# Altium schematic sheet AY Amp.SchDoc
size A3; SheetNumber: 3; SheetTotal: 15
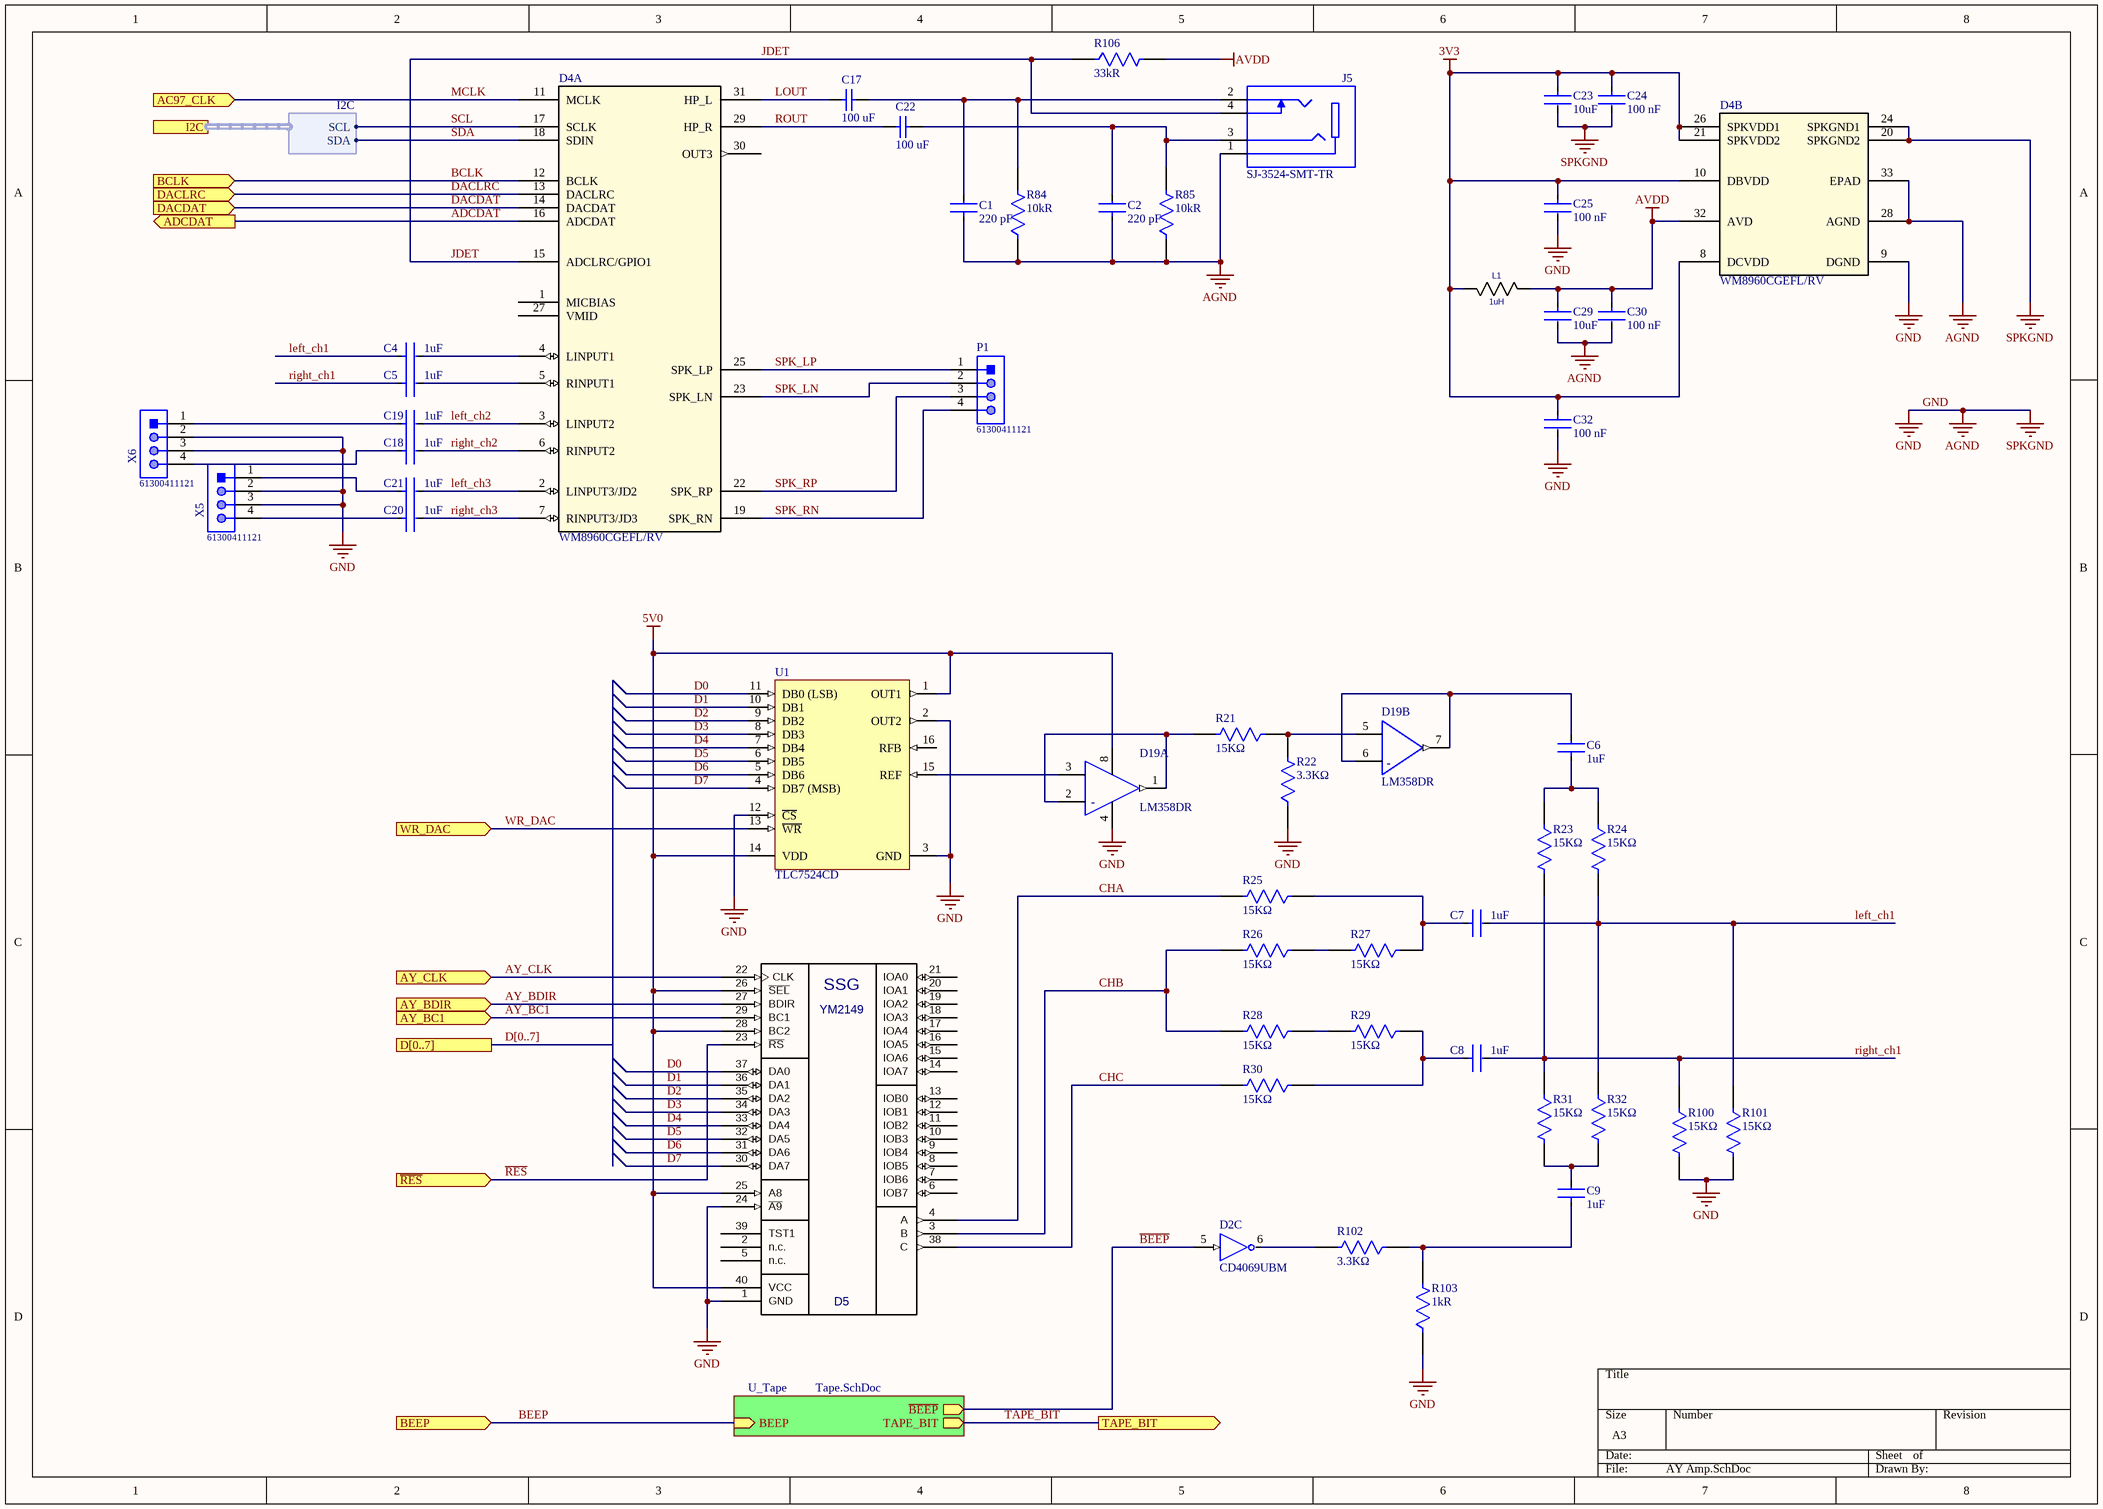
[diagram p0: AY Amp.SchDoc]

## Parts
C1  Capacitance: 220 pF  [FP-CC0805-0_85-IPC_A]  (hidden comment: CC0805KRX7R9BB221)
C2  Capacitance: 220 pF  [FP-CC0805-0_85-IPC_A]  (hidden comment: CC0805KRX7R9BB221)
C4  Capacitance: 1uF  [FP-GCM21B-0_15-IPC_A]  (hidden comment: GCM21BR71E105KA56L)
C5  Capacitance: 1uF  [FP-GCM21B-0_15-IPC_A]  (hidden comment: GCM21BR71E105KA56L)
C6  Capacitance: 1uF  [FP-GCM21B-0_15-IPC_A]  (hidden comment: GCM21BR71E105KA56L)
C7  Capacitance: 1uF  [FP-GCM21B-0_15-IPC_A]  (hidden comment: GCM21BR71E105KA56L)
C8  Capacitance: 1uF  [FP-GCM21B-0_15-IPC_A]  (hidden comment: GCM21BR71E105KA56L)
C9  Capacitance: 1uF  [FP-GCM21B-0_15-IPC_A]  (hidden comment: GCM21BR71E105KA56L)
C17  Capacitance: 100 uF  [CAPC3216X190X55ML30T25]  (hidden comment: GRM31CR60J107ME39L)
C18  Capacitance: 1uF  [FP-GCM21B-0_15-IPC_A]  (hidden comment: GCM21BR71E105KA56L)
C19  Capacitance: 1uF  [FP-GCM21B-0_15-IPC_A]  (hidden comment: GCM21BR71E105KA56L)
C20  Capacitance: 1uF  [FP-GCM21B-0_15-IPC_A]  (hidden comment: GCM21BR71E105KA56L)
C21  Capacitance: 1uF  [FP-GCM21B-0_15-IPC_A]  (hidden comment: GCM21BR71E105KA56L)
C22  Capacitance: 100 uF  [CAPC3216X190X55ML30T25]  (hidden comment: GRM31CR60J107ME39L)
C23  Capacitance: 10uF  [FP-C0805C-DG-IPC_A]  (hidden comment: C0805C106K8PACTU)
C24  Capacitance: 100 nF  [FP-CC0805-0_85-IPC_A]  (hidden comment: CC0805KRX7R9BB104)
C25  Capacitance: 100 nF  [FP-CC0805-0_85-IPC_A]  (hidden comment: CC0805KRX7R9BB104)
C29  Capacitance: 10uF  [FP-C0805C-DG-IPC_A]  (hidden comment: C0805C106K8PACTU)
C30  Capacitance: 100 nF  [FP-CC0805-0_85-IPC_A]  (hidden comment: CC0805KRX7R9BB104)
C32  Capacitance: 100 nF  [FP-CC0805-0_85-IPC_A]  (hidden comment: CC0805KRX7R9BB104)
D2  CD4069UBM  [FP-D0014A-IPC_A]  (part C of 7)
D4  WM8960CGEFL/RV  [QFN50P500X500X90_HS-33M]  (parts A,B of 2)
D5  YM2149  [DIP40]
D19  LM358DR  [FP-D0008A-MFG]  (parts A,B of 2)
J5  SJ-3524-SMT-TR  [SJ-3524-SMT-TR]
L1  value 1uH  [L-CHIP]  (hidden comment: L-CHIP)
P1  61300411121  [61300411121]
R21  Resistance: 15KΩ  [FP-RN732A-IPC_A]  (hidden comment: RN73C2A15KBTDF)
R22  Resistance: 3.3KΩ  [FP-RT0805-IPC_A]  (hidden comment: RT0805FRE073K3L)
R23  Resistance: 15KΩ  [FP-RN732A-IPC_A]  (hidden comment: RN73C2A15KBTDF)
R24  Resistance: 15KΩ  [FP-RN732A-IPC_A]  (hidden comment: RN73C2A15KBTDF)
R25  Resistance: 15KΩ  [FP-RN732A-IPC_A]  (hidden comment: RN73C2A15KBTDF)
R26  Resistance: 15KΩ  [FP-RN732A-IPC_A]  (hidden comment: RN73C2A15KBTDF)
R27  Resistance: 15KΩ  [FP-RN732A-IPC_A]  (hidden comment: RN73C2A15KBTDF)
R28  Resistance: 15KΩ  [FP-RN732A-IPC_A]  (hidden comment: RN73C2A15KBTDF)
R29  Resistance: 15KΩ  [FP-RN732A-IPC_A]  (hidden comment: RN73C2A15KBTDF)
R30  Resistance: 15KΩ  [FP-RN732A-IPC_A]  (hidden comment: RN73C2A15KBTDF)
R31  Resistance: 15KΩ  [FP-RN732A-IPC_A]  (hidden comment: RN73C2A15KBTDF)
R32  Resistance: 15KΩ  [FP-RN732A-IPC_A]  (hidden comment: RN73C2A15KBTDF)
R84  Resistance: 10kR  [FP-CR0805-IPC_A]  (hidden comment: CR0805-JW-103ELF)
R85  Resistance: 10kR  [FP-CR0805-IPC_A]  (hidden comment: CR0805-JW-103ELF)
R100  Resistance: 15KΩ  [FP-RN732A-IPC_A]  (hidden comment: RN73C2A15KBTDF)
R101  Resistance: 15KΩ  [FP-RN732A-IPC_A]  (hidden comment: RN73C2A15KBTDF)
R102  Resistance: 3.3KΩ  [FP-RT0805-IPC_A]  (hidden comment: RT0805FRE073K3L)
R103  Resistance: 1kR  [FP-CRCW0805-HPe3-IPC_A]  (hidden comment: CRCW08051K00FKEAHP)
R106  Resistance: 33kR  [FP-RMCF0805-IPC_A]  (hidden comment: RMCF0805JT33K0)
U1  TLC7524CD  [TI-D16_N]
X5  61300411121  [61300411121]
X6  61300411121  [61300411121]

## Sub-sheets
U_Tape = Tape.SchDoc: BEEP (in), TAPE_BIT (out), ~{BEEP} (out)

## Ports
AC97_CLK (in), ADCDAT (out), AY_BC1 (in), AY_BDIR (in), AY_CLK (in), BCLK (in), BEEP (in), D[0..7], DACDAT (in), DACLRC (in), I2C (harness I2C), TAPE_BIT (out), WR_DAC (in), ~{RES} (in)

## Harnesses
I2C: SDA, SCL

## Nets
3V3: C23.1 C24.1 C25.1 C32.1 D4.8(DCVDD) D4.10(DBVDD) D4.21(SPKVDD2) D4.26(SPKVDD1) L1.2
5V0: D5.25(A8) D5.26(~{SEL}) D5.28(BC2) D5.40(VCC) D19.8(V+) U1.1(OUT1) U1.14(VDD)
AVDD: C29.1 C30.1 D4.32(AVD) L1.1 R106.2
GND: C1.1 C2.1 C23.2 C24.2 C25.2 C29.2 C30.2 C32.2 D4.9(DGND) D4.20(SPKGND2) D4.24(SPKGND1) D4.28(AGND) D4.33(EPAD) D5.1(GND) D5.24(~{A9}) D19.4(V-) J5.1 R22.1 R84.1 R85.1 R100.2 R101.2 R103.1 U1.2(OUT2) U1.3(GND) U1.12(~{CS}) X5.2 X5.3 X6.2 X6.3  [also labelled AGND, SPKGND]
ADCDAT: D4.16(ADCDAT) ; port ADCDAT
AY_BC1: D5.29(BC1) ; port AY_BC1
AY_BDIR: D5.27(BDIR) ; port AY_BDIR
AY_CLK: D5.22(CLK) ; port AY_CLK
~{BEEP}: D2.5(C) ; sheet U_Tape/~{BEEP}
BCLK: D4.12(BCLK) ; port BCLK
BEEP: port BEEP, sheet U_Tape/BEEP
CHA: D5.4(A) R25.2
CHB: D5.3(B) R26.2 R28.2
CHC: D5.38(C) R30.2
D0: D5.37(DA0) U1.11(DB0_(LSB))
D1: D5.36(DA1) U1.10(DB1)
D2: D5.35(DA2) U1.9(DB2)
D3: D5.34(DA3) U1.8(DB3)
D4: D5.33(DA4) U1.7(DB4)
D5: D5.32(DA5) U1.6(DB5)
D6: D5.31(DA6) U1.5(DB6)
D7: D5.30(DA7) U1.4(DB7_(MSB))
DACDAT: D4.14(DACDAT) ; port DACDAT
DACLRC: D4.13(DACLRC) ; port DACLRC
JDET: D4.15(ADCLRC/GPIO1) J5.4 R106.1
left_ch1: C4.1 C7.2 R24.2 R32.1 R101.1
left_ch2: C19.2 D4.3(LINPUT2)
left_ch3: C21.2 D4.2(LINPUT3/JD2)
LOUT: C17.1 D4.31(HP_L)
MCLK: D4.11(MCLK) ; port AC97_CLK
~{RES}: D5.23(~{RS}) ; port ~{RES}
right_ch1: C5.1 C8.2 R23.2 R31.1 R100.1
right_ch2: C18.2 D4.6(RINPUT2)
right_ch3: C20.2 D4.7(RINPUT3/JD3)
ROUT: C22.1 D4.29(HP_R)
SCL: D4.17(SCLK) ; port I2C.SCL
SDA: D4.18(SDIN) ; port I2C.SDA
SPK_LN: D4.23(SPK_LN) P1.2
SPK_LP: D4.25(SPK_LP) P1.1
SPK_RN: D4.19(SPK_RN) P1.4
SPK_RP: D4.22(SPK_RP) P1.3
TAPE_BIT: port TAPE_BIT, sheet U_Tape/TAPE_BIT
WR_DAC: U1.13(~{WR}) ; port WR_DAC
NetC1_2: C1.2 C17.2 J5.2 R84.2
NetC2_2: C2.2 C22.2 J5.3 R85.2
NetC4_2: C4.2 D4.4(LINPUT1)
NetC5_2: C5.2 D4.5(RINPUT1)
NetC6_1: C6.1 R23.1 R24.1
NetC6_2: C6.2 D19.6(IN2-) D19.7(2OUT)
NetC7_1: C7.1 R25.1 R27.1
NetC8_1: C8.1 R29.1 R30.1
NetC9_1: C9.1 R102.1 R103.2
NetC9_2: C9.2 R31.2 R32.2
NetC18_1: C18.1 X6.4
NetC19_1: C19.1 X6.1
NetC20_1: C20.1 X5.4
NetC21_1: C21.1 X5.1
NetD2_6: D2.6(~{C}) R102.2
NetD19_1: D19.1(1OUT) D19.2(IN1-) R21.2
NetD19_3: D19.3(IN1+) U1.15(REF)
NetD19_5: D19.5(IN2+) R21.1 R22.2
NetR26_1: R26.1 R27.2
NetR28_1: R28.1 R29.2

Not connected (* = marked no-connect by the designer): D4 1(MICBIAS) 27(VMID) 30(OUT3); D5 2(n.c.) 5(n.c.) 6(IOB7) 7(IOB6) 8(IOB5) 9(IOB4) 10(IOB3) 11(IOB2) 12(IOB1) 13(IOB0) 14(IOA7) 15(IOA6) 16(IOA5) 17(IOA4) 18(IOA3) 19(IOA2) 20(IOA1) 21(IOA0) 39(TST1); U1 16(RFB)

## Buses and harness runs
bus D[0..7] = port D[0..7]

## Notes on the sheet
- (in symbol CMP-1685-00009-2, part A) -
- (in symbol CMP-1685-00009-2, part B) -
- (in symbol YM2149) SSG

## Library data of the parts
C1 C2 = CMP-1036-02315-3: CAP CER 220PF 50V X7R 0805; Manufacturer Part Number: VJ0805A221KXAPW1BC; Manufacturer: Vishay Vitramon; Value: 220 pF; Category: Cap; Case/Package: 0805
C4-C9 C18-C21 = CMP-2007-03346-2: Ceramic Capacitor for Automotive 1uF ±10% 25VDC X7R 0805 Embossed T/R; Manufacturer: Murata; Termination: SMD/SMT; Case/Package: 0805; Manufacturer Part Number: GCM21BR71E105KA56L; value: 1uF; Category: Cap
C17 C22 = CMP-1662-00011-2: Chip Capacitor, 100 uF, +/- 20%, 6.3 V, -55 to 85 degC, 1206 (3216 Metric), RoHS, Tape and Reel; Manufacturer: Murata; value: 100 uF; PackageDescription: 2-Pin Surface Mount Device, Body 3.2 x 1.6 mm; PartNumber: GRM31CR60J107ME39L; Manufacturer Part Number: GRM31CR60J107ME39L; Case/Package: 1206; Category: Cap
C23 C29 = CMP-2007-03243-2: CAP CER 10UF 10V X5R 0805; Manufacturer: KEMET; Manufacturer Part Number: C0805C106K8PACTU; Value: 10uF; Category: Cap; Case/Package: 0805
C24 C25 C30 C32 = CMP-2100-03606-3: CAP CER 0.1UF 50V X7R 0805; Manufacturer: Yageo; Value: 100 nF; Category: Cap; Manufacturer Part Number: CC0805KRX7R9BB104; Case/Package: 0805
D2 = CMP-1615-00195-3: IC INVERTER 6CH 6-INP 14SOIC; Manufacturer: Texas Instruments; Number of Pins: 14; Case/Package: SOIC; Manufacturer Part Number: CD4069UBM; value: CD4069UBM; Category: IC
D4 = WM8960CGEFL/RV: Stereo CODEC with 1W Stereo Class-D speaker Drivers; value: WM8960CGEFL/RV; Case/Package: QNF-32; Category: IC
D19 = CMP-1685-00009-2: IC OPAMP GP 2 CIRCUIT 8SOIC; Manufacturer: Texas Instruments; Case/Package: SOIC; Number of Pins: 8; Manufacturer Part Number: LM358DR; value: LM358DR; Category: IC
J5 = SJ-3524-SMT-TR: Connector; Case/Package: Stereo jack smd; Category: Connector; Value: SJ-3524-SMT-TR
P1 X5 X6 = CMP-1502-01064-1: THT Vertical Pin Header WR-PHD, Pitch 2.54 mm, Single Row, 4 pins; Manufacturer: Wurth Electronics; Pitch: 2.54mm; value: header 4 pin 2.54mm; Manufacturer Part Number: 61300411121; Case/Package: PLS-4; Category: Connector
R21 R23-R32 R100 R101 = CMP-03211-008328-1: SMD Chip Resistor, Thin Film, 15KΩ, 100 V, 0805 [2012 Metric], 100 mW, 0.1%, RN73 Series; Manufacturer: TE Connectivity; Manufacturer Part Number: RN73C2A15KBTDF; Category: Res; Value: 15KΩ; Case/Package: 0805
R22 R102 = CMP-03412-025935-1: RES SMD 3.3K OHM 1% 1/8W 0805; Manufacturer: Yageo; Value: 3.3KΩ; Manufacturer Part Number: RT0805FRE073K3L; Category: Res; Case/Package: 0805
R84 R85 = CMP-07231-003873-1: Thick Film Chip Resistors 0805 10kΩ 0.125W 5% 200ppm/°C; Manufacturer: Bourns; value: 10kΩ; Manufacturer Part Number: CR0805-JW-103ELF; Number of Terminations: 2; Termination: SMD/SMT; Number of Pins: 2; Case/Package: 0805; Category: Res
R103 = CMP-02407-004529-1: RES Thick Film, 1kΩ, 1%, 0.5W, 100ppm/°C, 0805; Manufacturer: Vishay Dale; Case/Package: 0805; Number of Pins: 2; Termination: Solder; Manufacturer Part Number: CRCW08051K00FKEAHP; value: 1kΩ; Category: Res
R106 = CMP-26527-001097-1: 33kΩ ±5% 0.125W 0805 Thick Film Chip Resistor AEC-Q200 compliant; Manufacturer: Stackpole Electronics; Number of Terminations: 2; Case/Package: 0805; Manufacturer Part Number: RMCF0805JT33K0; value: 33kΩ; Category: Res
U1 = CMP-0004-00046-1: 8-Bit, 0.1 us MDAC, Parallel Input, Fast Control Signalling for DSP, Easy Micro Interface, 0 to 70 degC, 16-pin SOIC (D16), Green (RoHS & no Sb/Br); Manufacturer: Texas Instruments; PackageDescription: 16-Pin Plastic Small Outline, Body 9.9 x 3.9 mm, Pitch 1.27 mm; PartNumber: TLC7524CD; Manufacturer Part Number: TLC7524CD; value: TLC7524CD; Case/Package: SOIC-16; Category: IC
D5 = YM2149: Value: YM2149; Case/Package: DIP-40; Category: IC
L1 = L-CHIP: Case/Package: 0805; Category: Inductor